# EAGLE schematic Fartreg 144V (EAGLE 4.16)
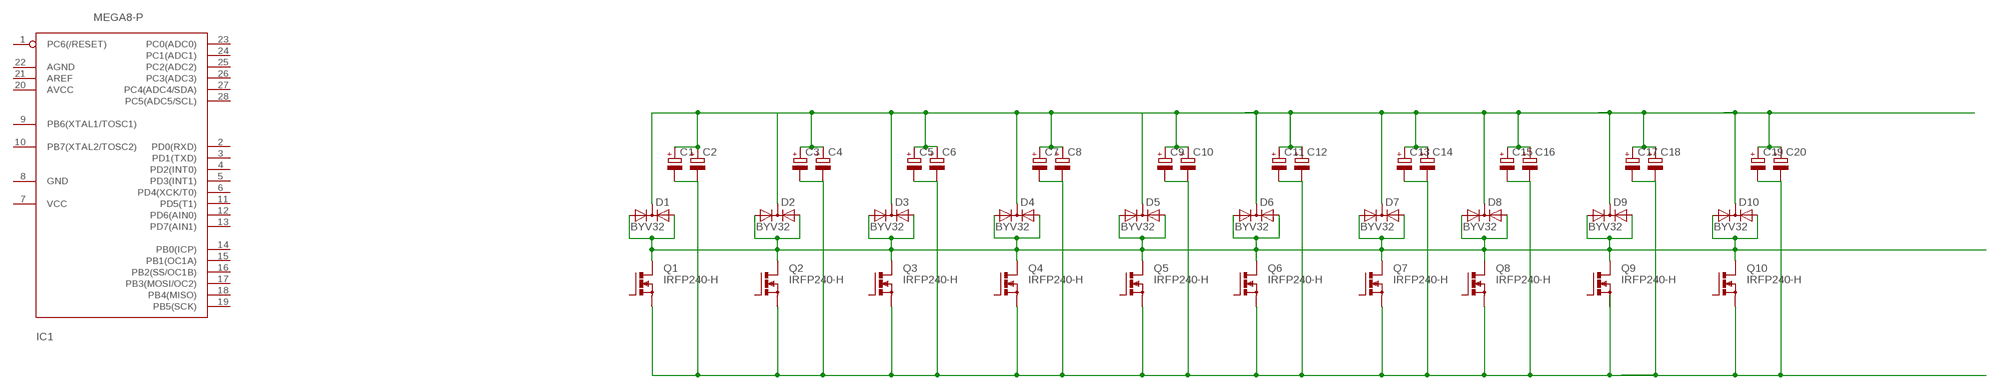
[diagram p0: schematic, sheet 1]

## Parts
C1  CPOL-EUE10-25  [EB25D]
C2  CPOL-EUE10-25  [EB25D]
C3  CPOL-EUE10-25  [EB25D]
C4  CPOL-EUE10-25  [EB25D]
C5  CPOL-EUE10-25  [EB25D]
C6  CPOL-EUE10-25  [EB25D]
C7  CPOL-EUE10-25  [EB25D]
C8  CPOL-EUE10-25  [EB25D]
C9  CPOL-EUE10-25  [EB25D]
C10  CPOL-EUE10-25  [EB25D]
C11  CPOL-EUE10-25  [EB25D]
C12  CPOL-EUE10-25  [EB25D]
C13  CPOL-EUE10-25  [EB25D]
C14  CPOL-EUE10-25  [EB25D]
C15  CPOL-EUE10-25  [EB25D]
C16  CPOL-EUE10-25  [EB25D]
C17  CPOL-EUE10-25  [EB25D]
C18  CPOL-EUE10-25  [EB25D]
C19  CPOL-EUE10-25  [EB25D]
C20  CPOL-EUE10-25  [EB25D]
D1  BYV32  [TO220ABS]
D2  BYV32  [TO220ABS]
D3  BYV32  [TO220ABS]
D4  BYV32  [TO220ABS]
D5  BYV32  [TO220ABS]
D6  BYV32  [TO220ABS]
D7  BYV32  [TO220ABS]
D8  BYV32  [TO220ABS]
D9  BYV32  [TO220ABS]
D10  BYV32  [TO220ABS]
IC1  MEGA8-P  [DIL28-3]
Q1  IRFP240-H  [TO247BH]
Q2  IRFP240-H  [TO247BH]
Q3  IRFP240-H  [TO247BH]
Q4  IRFP240-H  [TO247BH]
Q5  IRFP240-H  [TO247BH]
Q6  IRFP240-H  [TO247BH]
Q7  IRFP240-H  [TO247BH]
Q8  IRFP240-H  [TO247BH]
Q9  IRFP240-H  [TO247BH]
Q10  IRFP240-H  [TO247BH]

## Nets
N$1: C1.- C2.- C3.- C4.- C5.- C6.- C7.- C8.- C9.- C10.- C11.- C12.- C13.- C14.- C15.- C16.- C17.- C18.- C19.- C20.- Q1.S Q2.S Q3.S Q4.S Q5.S Q6.S Q7.S Q8.S Q10.S
N$4: D1.A1 D1.A2 D2.A1 D2.A2 D3.A1 D3.A2 D4.A1 D4.A2 D5.A1 D5.A2 D6.A1 D6.A2 D7.A1 D7.A2 D8.A1 D8.A2 D9.A1 D9.A2 D10.A1 D10.A2 Q1.D Q2.D Q3.D Q4.D Q5.D Q6.D Q7.D Q8.D Q9.D Q10.D
N$12: C1.+ C2.+ C3.+ C4.+ C5.+ C6.+ C7.+ C8.+ C9.+ C10.+ C11.+ C12.+ C13.+ C14.+ C15.+ C16.+ C17.+ C18.+ C19.+ C20.+ D1.C D2.C D3.C D4.C D5.C D6.C D7.C D8.C D9.C D10.C
Unconnected: IC1.1(PC6(/RESET)) IC1.2(PD0(RXD)) IC1.3(PD1(TXD)) IC1.4(PD2(INT0)) IC1.5(PD3(INT1)) IC1.6(PD4(XCK/T0)) IC1.7(VCC) IC1.8(GND) IC1.9(PB6(XTAL1/TOSC1)) IC1.10(PB7(XTAL2/TOSC2)) IC1.11(PD5(T1)) IC1.12(PD6(AIN0)) IC1.13(PD7(AIN1)) IC1.14(PB0(ICP)) IC1.15(PB1(OC1A)) IC1.16(PB2(SS/OC1B)) IC1.17(PB3(MOSI/OC2)) IC1.18(PB4(MISO)) IC1.19(PB5(SCK)) IC1.20(AVCC) IC1.21(AREF) IC1.22(AGND) IC1.23(PC0(ADC0)) IC1.24(PC1(ADC1)) IC1.25(PC2(ADC2)) IC1.26(PC3(ADC3)) IC1.27(PC4(ADC4/SDA)) IC1.28(PC5(ADC5/SCL)) Q1.G Q2.G Q3.G Q4.G Q5.G Q6.G Q7.G Q8.G Q9.G Q9.S Q10.G

## Library data of the parts
C1-C20 = rcl:CPOL-EU: POLARIZED CAPACITOR, European symbol
D1-D10 = diode:BYV32: DIODE 2 x Si diode 200 V, 20 A/230 Apeak, 25 ns
IC1 = atmel:MEGA8-P: MICROCONTROLLER 8 Kbytes FLASH 1 kbytes SRAM 512 bytes EEPROM USART 4-channel 10 bit ADC 2-channel 8 bit ADC Source: avr.lbr
Q1-Q10 = transistor-power:IRFP240: HEXFET Power MosFet Source: http://www.irf.com/